# EAGLE design Clock_M-D (EAGLE 9.6.2)
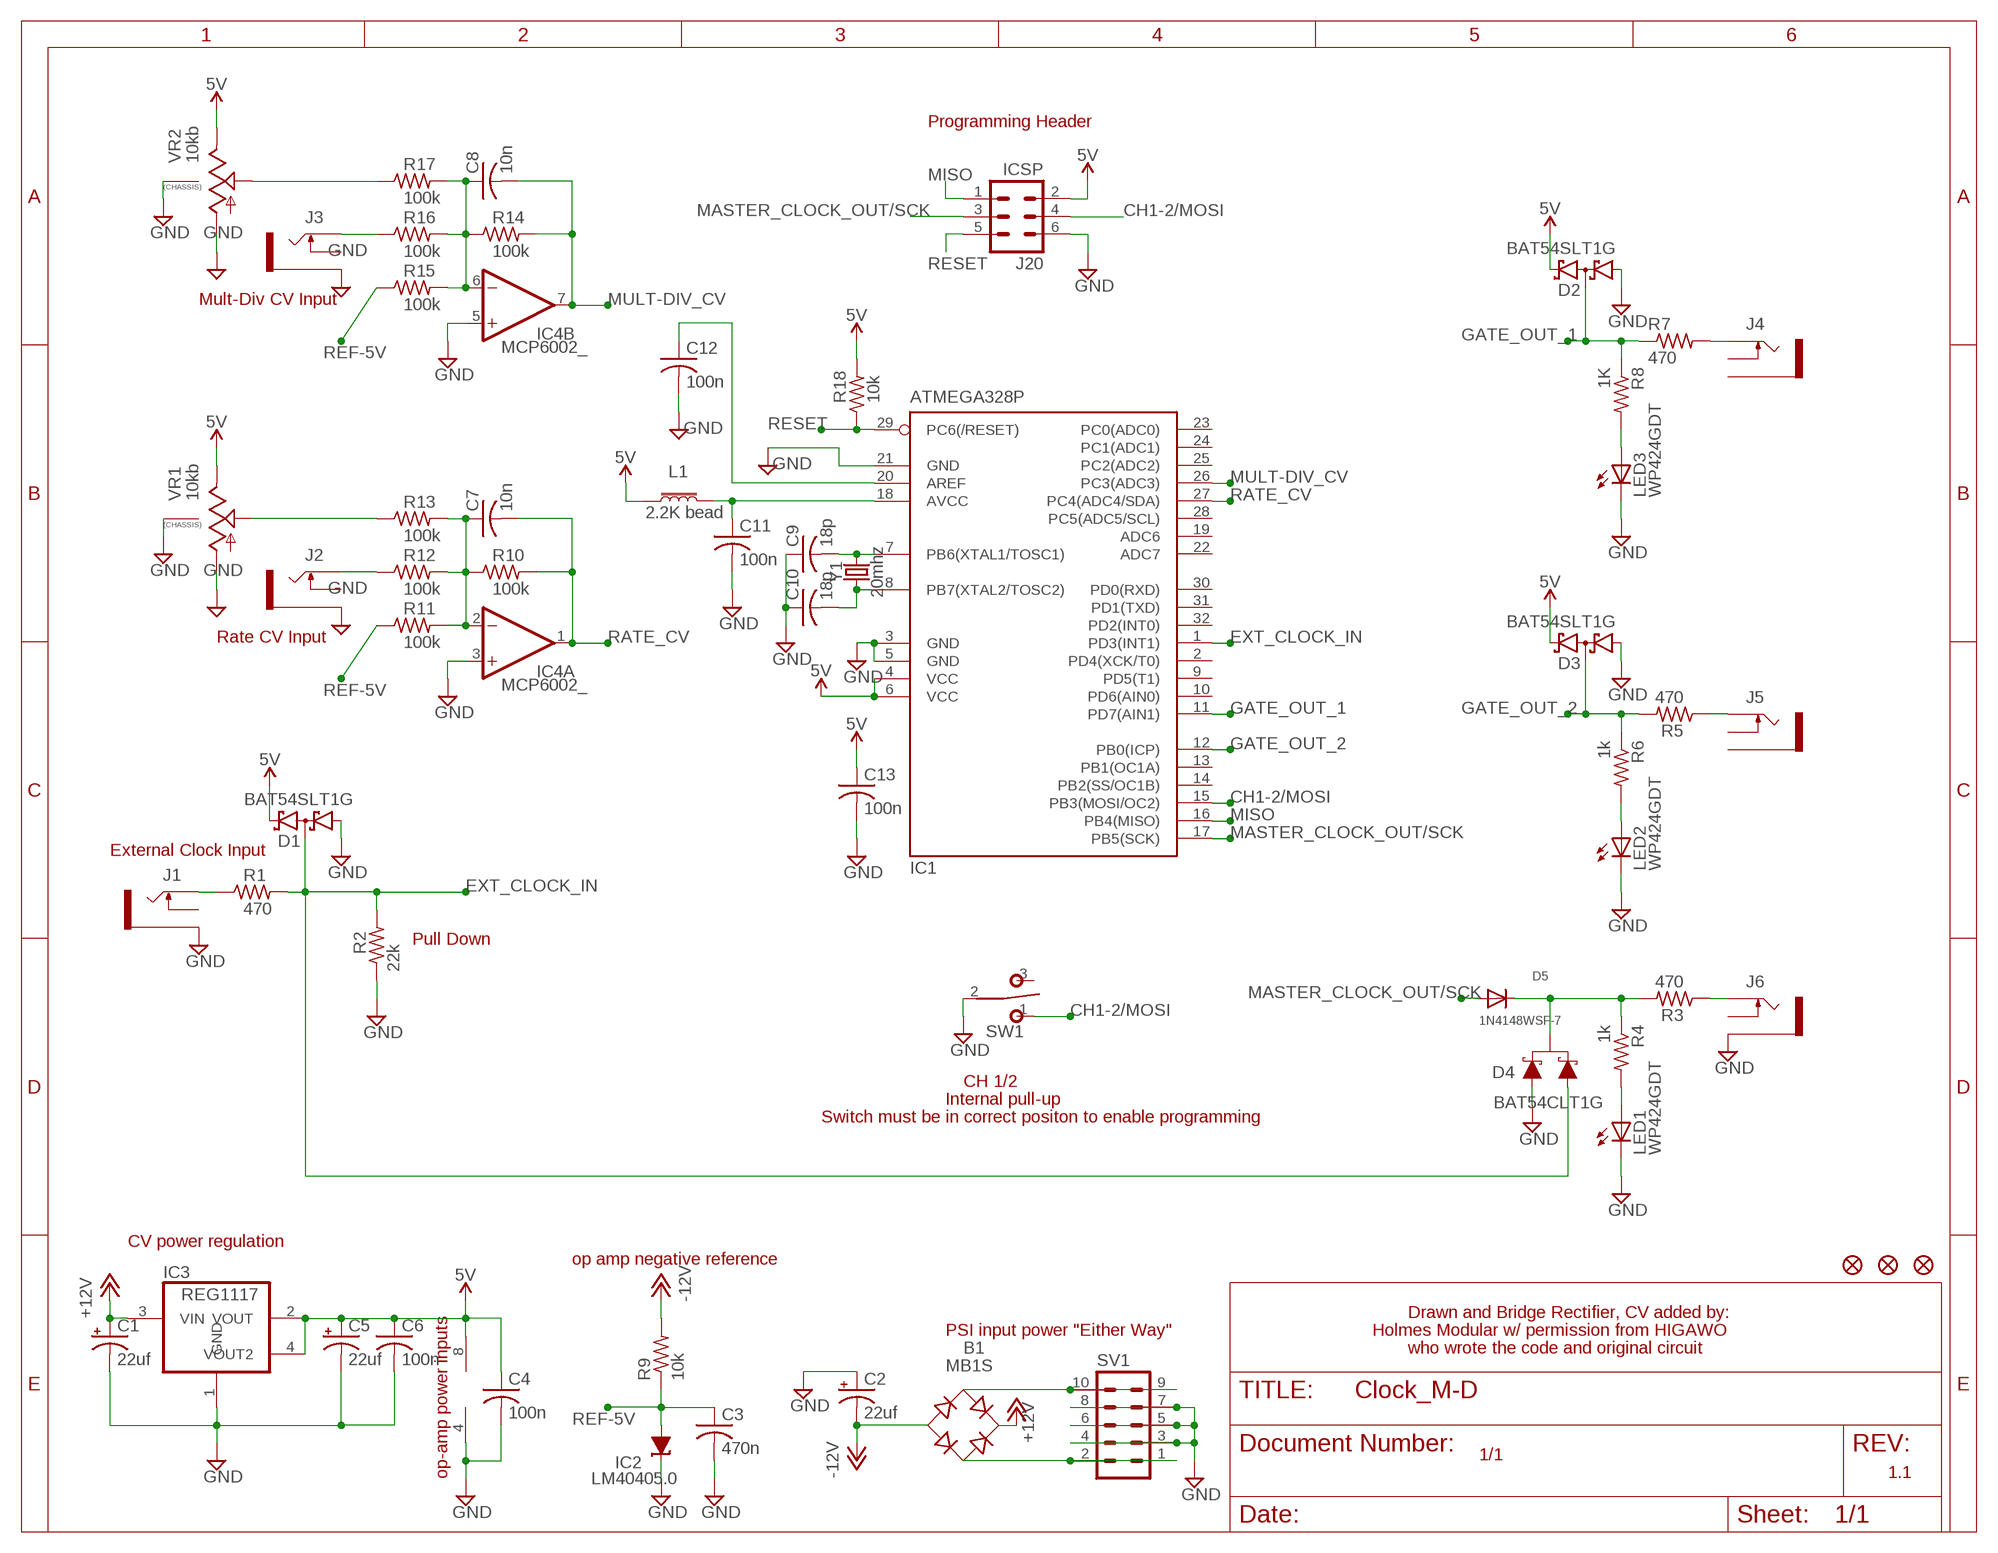
[diagram p0: schematic, sheet 1]

## Parts
B1  MB1S  [SOIC-4]
C1  22uf  CPOL-USC  [PANASONIC_C]
C2  22uf  CPOL-USC  [PANASONIC_C]
C3  470n  C-USC0805K  [C0805K]
C4  100n  C-USC0805K  [C0805K]
C5  22uf  CPOL-USC  [PANASONIC_C]
C6  100n  C-USC0805K  [C0805K]
C7  10n  C-USC0805K  [C0805K]
C8  10n  C-USC0805K  [C0805K]
C9  18p  C-USC0805K  [C0805K]
C10  18p  C-USC0805K  [C0805K]
C11  100n  C-USC0805K  [C0805K]
C12  100n  C-USC0805K  [C0805K]
C13  100n  C-USC0805K  [C0805K]
D1  BAT54SLT1G  BAS40-04  [SOT23]
D2  BAT54SLT1G  BAS40-04  [SOT23]
D3  BAT54SLT1G  BAS40-04  [SOT23]
D4  BAT54CLT1G  DIODE-SCHOTTKY-DUAL  [SOT23-3]
D5  1N4148WSF-7  DIODESOD-323F  [SOD-323F]
FD1  FIDUCIAL1X2  [FIDUCIAL-1X2]
FD2  FIDUCIAL1X2  [FIDUCIAL-1X2]
FD3  FIDUCIAL1X2  [FIDUCIAL-1X2]
IC1  ATMEGA328P  MEGA8-AI  [TQFP32-08]
IC2  LM40405.0  LM4041A12DBZ  [DBZ_R-PDSO-G3]
IC3  REG1117  [SOT223]
IC4  MCP6002_  [SO08]
J1  THONKICONNNEW  [WQP-PJ301M-12_JACK]
J2  THONKICONNNEW  [WQP-PJ301M-12_JACK]
J3  THONKICONNNEW  [WQP-PJ301M-12_JACK]
J4  THONKICONNNEW  [WQP-PJ301M-12_JACK]
J5  THONKICONNNEW  [WQP-PJ301M-12_JACK]
J6  THONKICONNNEW  [WQP-PJ301M-12_JACK]
J20  ICSP  MA03-2  [MA03-2]
L1  2.2K bead  FERRITE_BEAD-0603  [0603]
LED1  WP424GDT  LED3MM  [LED3MM]
LED2  WP424GDT  LED3MM  [LED3MM]
LED3  WP424GDT  LED3MM  [LED3MM]
R1  470  R-US_R0805  [R0805]
R2  22k  R-US_R0805  [R0805]
R3  470  R-US_R0805  [R0805]
R4  1k  R-US_R0805  [R0805]
R5  470  R-US_R0805  [R0805]
R6  1k  R-US_R0805  [R0805]
R7  470  R-US_R0805  [R0805]
R8  1K  R-US_R0805  [R0805]
R9  10k  R-US_R0805  [R0805]
R10  100k  R-US_R0805  [R0805]
R11  100k  R-US_R0805  [R0805]
R12  100k  R-US_R0805  [R0805]
R13  100k  R-US_R0805  [R0805]
R14  100k  R-US_R0805  [R0805]
R15  100k  R-US_R0805  [R0805]
R16  100k  R-US_R0805  [R0805]
R17  100k  R-US_R0805  [R0805]
R18  10k  R-US_R0805  [R0805]
SV1  EURO_POWER_HEADERLOCK  10PIN_BACKSIDE  [10PIN_BACKSIDE]
SW1  T-80-T-SPDT-ON-OFF-ON  [M9040P]
VR1  10kb  9MM_SNAP-IN_POT_CHASSIS  [9MM_SNAP-IN_POT]
VR2  10kb  9MM_SNAP-IN_POT_CHASSIS  [9MM_SNAP-IN_POT]
Y1  20mhz  CRYSTALSMD-5X3.2-2PAD  [CRYSTAL-SMD-5X3.2-2PAD]

## Nets
5V: C4.1 C5.+ C6.1 C13.1 D1.2(C2) D2.2(C2) D3.2(C2) IC1.4(VCC) IC1.6(VCC) IC3.2(VOUT) IC3.4(VOUT2) IC4.8(P:V+) J20.2 L1.1 R18.2 VR1.3(E) VR2.3(E)
+12V: B1.+ C1.+ IC3.3(VIN)
-12V: B1.- C2.- R9.2
CH1-2/MOSI: IC1.15(PB3(MOSI/OC2)) J20.4 SW1.1(O)
EXT_CLOCK_IN: D1.3(C1A2) D4.2(A1) IC1.1(PD3(INT1)) R1.2 R2.2
GATE_OUT_1: D2.3(C1A2) IC1.11(PD7(AIN1)) R7.1 R8.1
GATE_OUT_2: D3.3(C1A2) IC1.12(PB0(ICP)) R5.2 R6.1
GND: C1.- C2.+ C3.2 C4.2 C5.- C6.2 C9.1 C10.1 C11.2 C12.2 C13.2 D1.1(A1) D2.1(A1) D3.1(A1) D4.1(A) IC1.3(GND) IC1.5(GND) IC1.21(GND) IC2.1(C) IC3.1(GND) IC4.3(A:+IN) IC4.4(P:V-) IC4.5(B:+IN) J1.P$3_SLEEVE(SLEEVE) J2.P$3_SLEEVE(SLEEVE) J3.P$3_SLEEVE(SLEEVE) J6.P$3_SLEEVE(SLEEVE) J20.6 LED1.K(C) LED2.K(C) LED3.K(C) R2.1 SV1.3 SV1.4 SV1.5 SV1.6 SV1.7 SV1.8 SW1.2(P) VR1.1(A) VR1.CHASSIS1 VR1.CHASSIS2 VR2.1(A) VR2.CHASSIS1 VR2.CHASSIS2
MASTER_CLOCK_OUT/SCK: D5.A IC1.17(PB5(SCK)) J20.3
MISO: IC1.16(PB4(MISO)) J20.1
MULT-DIV_CV: C8.2 IC1.26(PC3(ADC3)) IC4.7(B:OUT) R14.2
N$1: B1.~1(AC1) SV1.9 SV1.10
N$2: B1.~2(AC2) SV1.1 SV1.2
N$3: J1.P$1_TIP(TIP) R1.1
N$4: D4.3(C) D5.C R3.2 R4.1
N$5: LED1.A R4.2
N$6: J6.P$1_TIP(TIP) R3.1
N$7: LED2.A R6.2
N$8: J5.P$1_TIP(TIP) R5.1
N$9: J4.P$1_TIP(TIP) R7.2
N$10: LED3.A R8.2
N$12: C7.1 IC4.2(A:-IN) R10.1 R11.2 R12.2 R13.2
N$13: J2.P$1_TIP(TIP) R12.1
N$14: R13.1 VR1.2(S)
N$15: R17.1 VR2.2(S)
N$16: J3.P$1_TIP(TIP) R16.1
N$17: C8.1 IC4.6(B:-IN) R14.1 R15.2 R16.2 R17.2
N$23: C11.1 IC1.18(AVCC) L1.2
N$24: C9.2 IC1.7(PB6(XTAL1/TOSC1)) Y1.P$2
N$25: C10.2 IC1.8(PB7(XTAL2/TOSC2)) Y1.P$1
N$26: C12.1 IC1.20(AREF)
RATE_CV: C7.2 IC1.27(PC4(ADC4/SDA)) IC4.1(A:OUT) R10.2
REF-5V: C3.1 IC2.2(A) R9.1 R11.1 R15.1
RESET: IC1.29(PC6(/RESET)) J20.5 R18.1
Unconnected: IC1.2(PD4(XCK/T0)) IC1.9(PD5(T1)) IC1.10(PD6(AIN0)) IC1.13(PB1(OC1A)) IC1.14(PB2(SS/OC1B)) IC1.19(ADC6) IC1.22(ADC7) IC1.23(PC0(ADC0)) IC1.24(PC1(ADC1)) IC1.25(PC2(ADC2)) IC1.28(PC5(ADC5/SCL)) IC1.30(PD0(RXD)) IC1.31(PD1(TXD)) IC1.32(PD2(INT0)) J1.P$2_SWITCH(SWITCH) J2.P$2_SWITCH(SWITCH) J3.P$2_SWITCH(SWITCH) J4.P$2_SWITCH(SWITCH) J4.P$3_SLEEVE(SLEEVE) J5.P$2_SWITCH(SWITCH) J5.P$3_SLEEVE(SLEEVE) J6.P$2_SWITCH(SWITCH) SW1.3(S)

## Notes on the sheet
- Programming Header
- Mult-Div CV Input
- Rate CV Input
- External Clock Input
- Pull Down
- CH 1/2
- Internal pull-up
- Switch must be in correct positon to enable programming
- CV power regulation
- op amp negative reference
- Drawn and Bridge Rectifier, CV added by:
- PSI input power "Either Way" | Holmes Modular w/ permission from HIGAWO
- who wrote the code and original circuit
- 1/1
- op-amp power inputs | 1.1

## Library data of the parts
B1 = rectifier:MB*S: Bridge Rectifier Source: http://www.fairchildsemi.com/ds/MB/MB6S.pdf
C1 C2 C5 = rcl:CPOL-US: POLARIZED CAPACITOR, American symbol; SPICEPREFIX: C
C3 C4 C6-C13 = rcl:C-US: CAPACITOR, American symbol; SPICEPREFIX: C
D1-D3 = diode:BAS40-04: Silicon Schottky Diodes General-purpose diode for high-speed switching
D4 = SparkFun-DiscreteSemi:DIODE-SCHOTTKY-DUAL: Diodes Incorporated - BAS70-05 Dual Schottky Diode Two Schottky Diodes in a single SOT-23 package. Low reverse current (100 nA) Vf: Datasheet referenced for footprint <https://www.diodes.com/assets/Datasheets/ds11007.pdf>; PROD_ID: DIO-14829; VALUE: BAS70-05
D5 = adafruit:DIODE: Diode SMADIODE - SMA Surface Mount Package 20V 1A Schottky Diode Digikey: 641-1014-6-ND DO-1N4148 - Through Hole Small Current Diode SOD-123 20V 1 A (.5mV Vf) Schottky Diode - Digikey: MBRX120TPMSCT-ND SOD-323 10V 570mA (.38mV Vf, 3ns) Schottky Diode - Digikey: ZLLS410CT-ND SOD-523 30V 30mA Schottky Diode (RB751S-40TE61) - Digikey: RB751S-40TE61CT-ND SOT23-R/W - SOT23 Package (R = Solder Paste/Reflow Ovens, W = Hand-Soldering) BAT54Film 40V 300mA - Digikey: 497-7162-1-ND
FD1-FD3 = SparkFun-Aesthetics:FIDUCIAL: Fiducial Alignment Points Point-of-reference for pick-and-place machines and other optical instruments.
IC1 = atmel:MEGA8: MICROCONTROLLER 8 Kbytes FLASH, 1 kbytes SRAM, 512 bytes EEPROM, USART, 6-channel 10 bit ADC, 2-channel 8 bit ADC Pin compatible with Atmega48, ATMega88, ATMega168 Source: avr.lbr; MPN: ATMEGA8-16AU; OC_FARNELL: 9171371; OC_NEWARK: 73M8863
IC2 = texas:LM4041: PRECISION MICROPOWER SHUNT VOLTAGE REFERENCE Source: http://focus.ti.com/lit/ds/slcs146e/slcs146e.pdf; MPN: LM4041A12IDBZR; OC_FARNELL: 1407949; OC_NEWARK: 58K5875
IC3 = burr-brown:REG1117: 800mA and 1A Low Dropout (LDO) Positive Regulator 1.8V, 2.5V, 2.85V, 3.3V, 5V, and Adj; MPN: REG1117; OC_FARNELL: 1097566; OC_NEWARK: 14P6981
IC4 = MusicThingModular:MCP6002: Generic Dual Op Amp
J1-J6 = MusicThingModular:THONKICONN: 3.5mm socket for Eurorack modular synths
J20 = con-lstb:MA03-2: PIN HEADER; OC_FARNELL: unknown; OC_NEWARK: unknown
L1 = SparkFun-Coils:FERRITE_BEAD: Ferrite Bead (blocks, cores, rings, chokes, etc.) Inductor with layers of ferrite used to suppress high frequencies. Often used to isolate high frequency noise. SparkFun Products: IOIO-OTG - V2.2 <https://www.sparkfun.com/products/13613> SparkFun SAMD21 Mini Breakout <https://www.sparkfun.com/products/13664> SparkFun 6 Degrees of Freedom Breakout - LSM6DS3 <https://www.sparkfun.com/products/13339> SparkFun SAMD21 Dev Breakout <https://www.sparkfun.com/products/13672> Lilypad MP3 <https://www.sparkfun.com/products/11013>; PROD_ID: NDUC-13805; VALUE: 30Ω/1.8A
LED1-LED3 = adafruit:LED: LED OSRAM: - CHIPLED LG R971, LG N971, LY N971, LG Q971, LY Q971, LO R971, LY R971 LH N974, LH R974 LS Q976, LO Q976, LY Q976 LO Q996 - Hyper CHIPLED LW Q18S LB Q993, LB Q99A, LB R99A - SideLED LS A670, LO A670, LY A670, LG A670, LP A670 LB A673, LV A673, LT A673, LW A673 LH A674 LY A675 LS A676, LA A676, LO A676, LY A676, LW A676 LS A679, LY A679, LG A679 - Hyper Micro SIDELED® LS Y876, LA Y876, LO Y876, LY Y876 LT Y87S - SmartLED LW L88C, LW L88S LB L89C, LB L89S, LG L890 LS L89K, LO L89K, LY L89K LS L896, LA L896, LO L896, LY L896 - TOPLED LS T670, LO T670, LY T670, LG T670, LP T670 LSG T670, LSP T670, LSY T670, LOP T670, LYG T670 LG T671, LOG T671, LSG T671 LB T673, LV T673, LT T673, LW T673 LH T674 LS T676, LA T676, LO T676, LY T676, LB T676, LH T676, LSB T676, LW T676 LB T67C, LV T67C, LT T67C, LS T67K, LO T67K, LY T67K, LW E67C LS E67B, LA E67B, LO E67B, LY E67B, LB E67C, LV E67C, LT E67C LW T67C LS T679, LY T679, LG T679 LS T770, LO T770, LY T770, LG T770, LP T770 LB T773, LV T773, LT T773, LW T773 LH T774 LS E675, LA E675, LY E675, LS T675 LS T776, LA T776, LO T776, LY T776, LB T776 LHGB T686 LT T68C, LB T68C - Hyper Mini TOPLED® LB M676 - Mini TOPLED Santana® LG M470 LS M47K, LO M47K, LY M47K Source: http://www.osram.convergy.de/
R1-R18 = rcl:R-US_: RESISTOR, American symbol; SPICEPREFIX: R
SV1 = MusicThingModular:10PIN_BACKSIDE: PIN HEADER; OC_FARNELL: unknown; OC_NEWARK: unknown
SW1 = MusicThingModular:T-80-T-SPDT-ON-OFF-ON
VR1 VR2 = MusicThingModular:9MM_SNAP-IN_POT_CHASSIS: 9mm vertical snap-in pot, Alpha / Panasonic style, with a connection to the metal chassis for grounding
Y1 = SparkFun-Clocks:CRYSTAL: Crystals (Generic) These are passive quartz crystals, which can be used as a clock source for a microcontroller. Crystal's are two-terminal devices. They require external "load" capacitors to generate an oscillating signal.

## Board
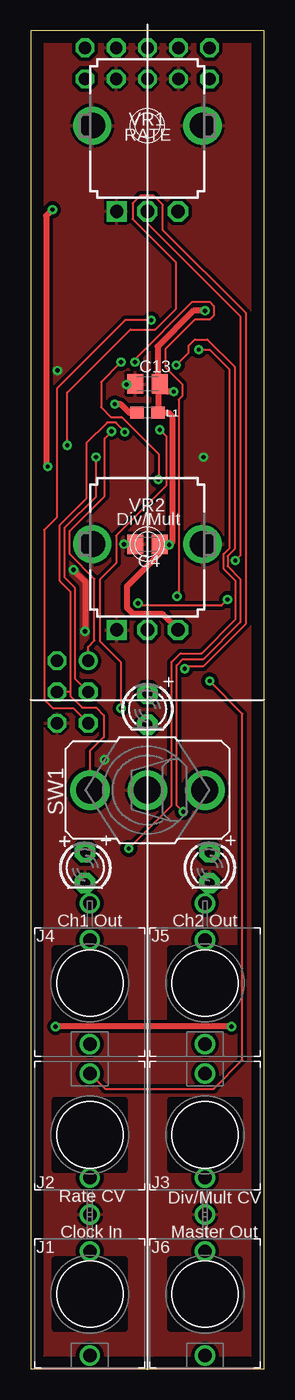
[diagram p1: board, top side]
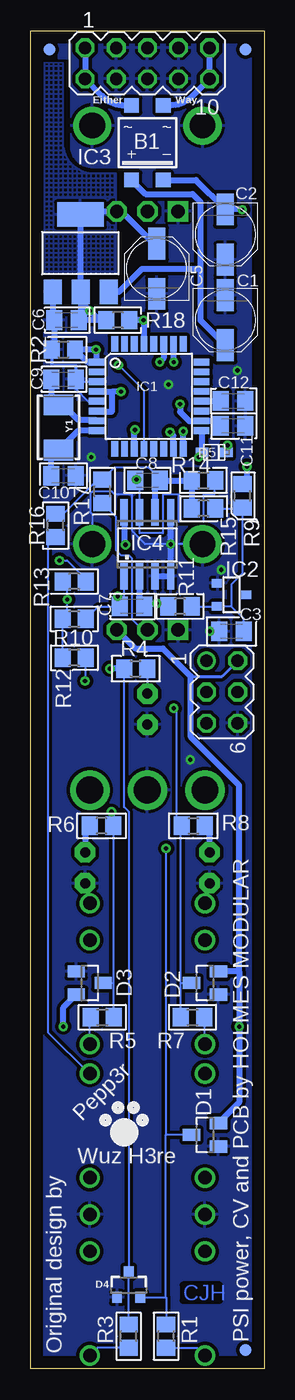
[diagram p2: board, bottom side, seen from below]

Size 19.05 x 109.22 mm. Coordinates in mm from the lower left corner, seen from the top.
Outline: 0,0 19.05,0 19.05,109.22 0,109.22 0,0
Copper layers (1*16): Top 0.035mm / dielectric 1.5mm / Bottom 0.035mm
Design rules "default": minimum track width 6mil, minimum drill 0.35mm, track to track 6mil, track to pad 6mil, pad to pad 6mil, via to via 6mil, smd to smd 6mil, copper to edge 40mil, drill to drill 6mil, minimum pad ring 10mil, minimum via ring 8mil, stop-mask expansion 4mil, vias tented up to drill 0mil, thermal gap 10mil
bRestrict: area 14.5,78 to 15.2,78.6; 2 lines

### Footprints (pad centres in the part's own frame; a part is rotated, then mirrored left to right if it is on the bottom)
SOIC-4 = smd 1.2 x 1.2: + 1.3,3.05; - -1.3,3.05; ~1 -1.3,-3.05; ~2 1.3,-3.05
PANASONIC_C = smd 2.6 x 1.4: + 2.05,0; - -2.05,0
C0805K = smd 1.3 x 1.6: 1 -1,0; 2 1,0
SOT23 = smd 1 x 1.4: 1 -0.95,-1.1; 2 0.95,-1.1; 3 0,1.1
SOT23-3 = smd 0.8 x 0.9: 1 -0.95,-1; 2 0.95,-1; 3 0,1.1
SOD-323F = smd 1 x 0.8: A -1,0; C 1,0
FIDUCIAL-1X2 = smd 1 x 1: 1 0,0
TQFP32-08 = smd 1.27 x 0.559: 1 -4.293,2.8; 2 -4.293,2; 3 -4.293,1.2; 4 -4.293,0.4; 5 -4.293,-0.4; 6 -4.293,-1.2; 7 -4.293,-2; 8 -4.293,-2.8; 17 4.293,-2.8; 18 4.293,-2; 19 4.293,-1.2; 20 4.293,-0.4; 21 4.293,0.4; 22 4.293,1.2; 23 4.293,2; 24 4.293,2.8 | smd 0.559 x 1.27: 9 -2.8,-4.293; 10 -2,-4.293; 11 -1.2,-4.293; 12 -0.4,-4.293; 13 0.4,-4.293; 14 1.2,-4.293; 15 2,-4.293; 16 2.8,-4.293; 25 2.8,4.293; 26 2,4.293; 27 1.2,4.293; 28 0.4,4.293; 29 -0.4,4.293; 30 -1.2,4.293; 31 -2,4.293; 32 -2.8,4.293
DBZ_R-PDSO-G3 = smd 0.7 x 1: 1 -0.95,-1.1; 2 0.95,-1.1; 3 0,1.1
SOT223 = smd 1.499 x 2.007: 1 -2.261,-3.15; 2 0.025,-3.15; 3 2.311,-3.15 | smd 3.81 x 2.007: 4 0,3.15
SO08 = smd 0.6 x 2.2: 1 -1.905,-2.6; 2 -0.635,-2.6; 3 0.635,-2.6; 4 1.905,-2.6; 5 1.905,2.6; 6 0.635,2.6; 7 -0.635,2.6; 8 -1.905,2.6
WQP-PJ301M-12_JACK = drill 1.1: P$1_TIP 0,5; P$2_SWITCH 0,-3.5; P$3_SLEEVE 0,-6.5
MA03-2 = drill 1.016: 1 -2.54,-1.27 | drill 1.016 octagon: 2 -2.54,1.27; 3 0,-1.27; 4 0,1.27; 5 2.54,-1.27; 6 2.54,1.27
0603 = smd 1.1 x 1: 1 -0.85,0; 2 0.85,0
LED3MM = drill 0.813 pad 1.676 octagon: A -1.27,0; K 1.27,0
R0805 = smd 1.3 x 1.5: 1 -0.95,0; 2 0.95,0
10PIN_BACKSIDE = drill 1.016 octagon: 1 -5.08,-1.27; 2 -5.08,1.27; 3 -2.54,-1.27; 4 -2.54,1.27; 5 0,-1.27; 6 0,1.27; 7 2.54,-1.27; 8 2.54,1.27; 9 5.08,-1.27; 10 5.08,1.27
M9040P = drill 2.2: 1 0,4.699 | drill 2.2 pad 3: 2 0,0; 3 0,-4.699
9MM_SNAP-IN_POT = drill 1.1 square: 1 -2.5,-7 | drill 1.1 octagon: 2 0,-7; 3 2.5,-7 | drill 2.1 pad 2.794: CHASSIS1 -4.5,0; CHASSIS2 4.5,0
CRYSTAL-SMD-5X3.2-2PAD = smd 1.7 x 2.4: P$1 1.85,0; P$2 -1.85,0

### Placement (x,y rotation side)
B1  9.53,100.08 180 bottom
C1  3.17,85.6 270 bottom
C2  3.17,92.58 270 bottom
C3  2.67,60.2 180 bottom
C4  9.53,67.31 180 top
C5  8.76,89.79 90 bottom
C6  16.13,85.6 180 bottom
C7  10.79,62.23 180 bottom
C8  9.53,72.52 180 bottom
C9  16.38,80.77 180 bottom
C10  16.38,72.9 180 bottom
C11  2.54,76.96 0 bottom
C12  2.54,78.99 0 bottom
C13  9.53,80.39 180 top
D1  4.83,19.1 90 bottom
D2  4.83,31.5 90 bottom
D3  14.22,31.5 270 bottom
D4  11.05,6.83 0 bottom
D5  4.06,74.8 0 bottom
FD1  1.52,107.7 0 bottom
FD2  17.53,107.7 0 bottom
FD3  1.52,1.52 0 bottom
IC1  9.4,79.38 0 bottom
IC2  LM4040.....  [DBZ_R-PDSO-G3]  2.67,63.18 270 bottom
IC3  14.99,91.06 0 bottom
IC4  9.53,67.31 0 bottom
J1  4.83,6.1 180 top
J2  4.83,19.1 0 top
J3  14.22,19.1 0 top
J4  4.83,31.5 180 top
J5  14.22,31.5 180 top
J6  14.22,6.1 180 top
J20  3.43,55.24 270 bottom
L1  9.53,78.04 180 top
LED1  9.53,53.85 270 top
LED2  14.61,40.89 270 top
LED3  4.45,40.89 270 top
R1  8,2.67 90 bottom
R2  16.38,83.19 0 bottom
R3  11.05,2.67 90 bottom
R4  10.48,57.15 0 bottom
R5  13.21,28.7 0 bottom
R6  13.27,44.32 180 bottom
R7  5.84,28.7 0 bottom
R8  5.78,44.32 0 bottom
R9  1.78,71.25 90 bottom
R10  15.49,61.21 0 bottom
R11  6.86,62.23 180 bottom
R12  15.49,58.04 180 bottom
R13  15.49,64.26 180 bottom
R14  4.95,72.52 0 bottom
R15  4.95,70.23 180 bottom
R16  17.02,68.83 90 bottom
R17  13.21,71.63 90 bottom
R18  11.94,85.6 180 bottom
SV1  9.53,106.55 180 top
SW1  9.53,47.24 90 top
VR1  9.53,101.47 0 top
VR2  9.53,67.31 0 top
Y1  16.76,76.83 270 bottom

### Tracks (layer width: path | path; a pad name or v marks a point on that pad's centre or on a via)
5V  (via drill 0.35)
  Top 0.508: v11.3,67.25 10.59,67.25 C4.1 | v16.38,27.94 v2.03,27.94 | v11.3,67.25 11.56,67.5 11.56,77.75 11.26,78.04 L1.1 10.4,78.04 10.4,80.26 C13.1 11.16,79.76 v11.68,79.76 10.35,79.76 10.35,83.44 13.27,86.36 v14.22,86.36 | VR2.3 12.03,60.37 10.79,61.59 8.38,61.59 7.87,62.1 7.87,63.88 10.48,66.48 10.48,67.25 v11.3,67.25
  Bottom 0.254: J20.2 3.43,56.52 5.97,56.52
  Bottom 0.508: C5.+ 9.01,91.84 11.65,94.47 VR1.3 14.72,94.47 IC3.4 14.99,87.94 IC3.2 | IC3.2 14.96,85.77 C6.1 | C6.1 R18.2 13.46,85.6 v14.22,86.36 | IC4.8 11.43,67.37 v11.3,67.25 | IC1.4 13.67,79.76 12.45,79.76 | 12.45,79.76 12.45,78.11 13.62,78.11 IC1.6 | IC3.2 14.96,87.1 v14.22,86.36 | C6.1 14.37,86.36 v14.22,86.36 | v11.68,79.76 12.45,79.76 | D1.2 2.03,21.75 v2.03,27.94 2.03,32.45 | v16.38,27.94 16.38,29.49 D3.2 | 2.03,32.45 D2.2 | 2.03,32.45 2.03,47.62 5.97,51.56 5.97,56.52 8.26,58.8 10.52,58.8 VR2.3
  pour Bottom (hatched): 18.03,89.41 12.06,89.41 12.06,97.54 13.84,97.54 arc90 16.38,100.08 16.38,106.55 18.03,106.55
+12V
  Bottom 0.508: B1.+ 9.68,95.89 5.84,95.89 5.21,95.25 5.21,89.79 | C1.+ 5.21,85.58 5.21,89.79 | 5.21,89.79 9.96,89.79 11.84,87.91 IC3.3
-12V  (via drill 0.35)
  Top 0.508: v1.78,94.61 1.27,94.11 1.27,73.76 v1.4,73.64
  Bottom 0.152: 1.4,73.53 v1.4,73.64
  Bottom 0.508: B1.- 5.57,97.03 C2.- 1.8,94.63 v1.78,94.61 | R9.2 1.4,72.58 1.4,73.53
CH1-2/MOSI  (via drill 0.35)
  Top 0.152: v7.68,76.45 7.68,76.5 6.94,77.24 6.24,77.24 4.56,75.56 4.56,71.04 2.35,68.83 2.35,64.33 3.25,63.42 3.25,55.24 | 3.25,55.24 J20.4 | 3.25,55.24 3.25,54.91 4.19,53.98 5.33,53.98 5.97,53.34 5.97,51.56 4.83,50.42 SW1.1
  Bottom 0.508: IC1.15 7.4,76.17 v7.68,76.45
EXT_CLOCK_IN  (via drill 0.35)
  Top 0.152: v13.72,83.19 14.62,83.19 16.19,81.61 16.19,66.95 15.75,66.51 15.75,65.29 16.71,64.33 16.71,61.16 13.95,58.4 12.21,58.4 11.51,57.7 11.51,45.99 v8,42.48
  Bottom 0.152: D4.2 8.01,5.83 | 8.01,5.83 8,5.84 R1.2 | 8.01,5.83 8.01,19.09 | 8.01,19.09 8,19.1 D1.3 | v8,42.48 v8.01,42.47 8.01,19.09
  Bottom 0.508: R2.2 14.42,82.17 IC1.1 13.72,82.17 v13.72,83.19 R2.2
GATE_OUT_1  (via drill 0.35)
  Top 0.152: v10.54,76.64 11.05,76.14 11.05,72.07 6.98,68 6.98,65.76 5.65,64.44 5.65,59.39 7.37,57.68 v7.37,53.91
  Bottom 0.152: v7.37,53.91 7.18,53.72 7.18,44.77 R8.1 6.79,44.32 6.79,31.5 | R7.1 6.79,31.5 | 6.79,31.5 D2.3
  Bottom 0.508: IC1.11 10.6,76.37 10.54,76.43 v10.54,76.64
GATE_OUT_2  (via drill 0.35)
  Top 0.152: v12.44,45.47 11.91,45.99 11.91,57.42 12.43,57.94 14.12,57.94 17.12,60.94 17.12,64.45 16.07,65.51 16.07,66.34 16.64,66.91 16.64,81.79 14.41,84.01 13.4,84.01 12.89,83.5 12.89,82.93 v11.87,81.92
  Top 0.254: v12.45,45.47 v12.44,45.47
  Bottom 0.152: R6.1 12.32,31.5 | 12.32,31.5 12.32,28.77 | D3.3 12.32,31.5 | IC1.12 9.8,79.84 v11.87,81.92
  Bottom 0.508: 12.32,28.77 arc-90 R5.2 | v12.45,45.47 12.45,44.45 R6.1
GND  (via drill 0.35)
  Top 0.508: C4.2 v7.62,67.31 | v3.49,65.22 4.45,64.26 v4.45,60.2
  Bottom 0.152: 15.37,80.79 C9.1 | C9.1 15.19,80.58 IC1.3 | IC1.5 13.72,78.95 14.33,78.95 15.38,80 C9.1 | VR2.CHASSIS1 9.7,67.31 10.77,68.38 10.77,71.37 12.17,71.37 12.43,71.62 13.99,71.62 14.19,71.42 14.19,69.93 14.03,69.77 VR2.CHASSIS2
  Bottom 0.254: R2.1 17.33,81.98 17.27,81.92 15.37,81.92 15.37,80.79
  Bottom 0.508: IC4.5 v7.62,67.31 IC4.4 IC4.3 | IC3.1 17.25,85.72 C6.2 17.13,83.39 R2.1
  other vias: 7.81,80.33 2.18,81.48 6.03,49.72 14.1,74.42
  pour Bottom (isolate 0.279): 0,0 19.05,0 19.05,88.9 11.43,88.9 11.43,98.04 13.97,98.04 arc90 15.75,99.82 15.75,106.93 16.76,106.93 16.76,107.7 arc-90 17.53,108.46 18.8,108.46 arc-90 19.05,108.2 19.05,109.22 0,109.22
  pour Top (isolate 0.305): 19.05,109.22 0,109.22 0,0 19.05,0
MASTER_CLOCK_OUT/SCK  (via drill 0.35)
  Top 0.152: v5.33,74.42 5.33,71.18 2.76,68.61 2.76,64.61 3.61,63.77 3.61,56.34 J20.3
  Bottom 0.508: IC1.17 5.11,74.84 D5.A 5.33,74.53 v5.33,74.42
MISO  (via drill 0.35)
  Top 0.152: v6.6,76.52 6.03,75.95 6.03,71.25 3.17,68.39 3.17,66.51 5.21,64.47 5.21,59.44 4.7,58.93 J20.1
  Bottom 0.508: IC1.16 v6.6,76.51 v6.6,76.52
MULT-DIV_CV  (via drill 0.35)
  Top 0.152: v7.37,82.17 5.74,80.55 5.74,78.49 6.54,77.7 7.43,77.7 10.45,74.67 10.45,72.62 v10.41,72.58
  Bottom 0.152: 10.16,72.15 IC4.7 10.16,68.2 8.26,68.2 8.26,71.37 6.96,71.37 6.96,69.15 4.96,69.15 4.96,71.37 4.06,71.37 4.06,72.46 R14.2 | C8.2 10.48,72.52 v10.41,72.58
  Bottom 0.508: 10.16,72.15 C8.2 | v7.37,82.17 7.37,83.64 IC1.26
N$1
  Bottom 0.508: SV1.9 SV1.10 5.86,103.87 arc45 7.65,103.13 B1.~1
N$2
  Bottom 0.508: SV1.1 SV1.2 13.19,103.87 arc-45 11.4,103.13 B1.~2
N$3
  Bottom 0.152: R1.1 5.45,1.72 J1.P$1_TIP
N$4  (via drill 0.35)
  Top 0.152: v2.98,75.37 2.98,79.69 8.13,84.84 10.16,84.84 11.87,86.55 11.87,90.3 8.32,93.85 8.32,95.12 8.96,95.76 10.03,95.76 10.78,95.01 10.78,92.95 17.54,86.19 17.54,60.79 14.08,57.33 12.75,57.33 v12.57,57.15
  Bottom 0.152: R3.2 D4.3 11.06,7.95 11.06,45.48 11.43,45.85 R4.1
  Bottom 0.508: D5.C 3.06,75.3 v2.98,75.37 | R4.1 v12.57,57.15
N$5
  Bottom 0.152: R4.2 LED1.A
  Bottom 0.508: LED1.A arc-90 LED1.A
N$6
  Bottom 0.152: R3.1 13.6,1.72 J6.P$1_TIP
N$7
  Bottom 0.508: LED2.A 14.6,43.94 R6.2
N$8
  Bottom 0.152: J5.P$1_TIP 14.22,28.64
  Bottom 0.508: 14.22,28.64 R5.1
N$9
  Bottom 0.152: J4.P$1_TIP 4.83,28.64
  Bottom 0.508: 4.83,28.64 R7.2
N$10
  Bottom 0.508: LED3.A 4.45,43.94 R8.2
N$12  (via drill 0.35)
  Top 0.152: v8.76,62.48 8.97,62.28 15.56,62.28 v16.07,62.79
  Bottom 0.152: R12.2 R10.1 16.07,61.59 v16.07,62.79 16.07,63.88 R13.2
  Bottom 0.508: IC4.2 10.16,62.59 C7.1 9.54,62.48 v8.76,62.48 8.06,62.48 R11.2
N$13  (via drill 0.35)
  Top 0.152: J2.P$1_TIP 6.07,22.86 14.92,22.86 17.27,25.21 17.27,53.47 v14.61,56.13
  Bottom 0.152: 14.61,57.98 v14.61,56.13
  Bottom 0.508: R12.1 14.61,57.98
N$14  (via drill 0.35)
  Top 0.152: VR1.2 9.53,93.5 17.11,85.92 17.11,66.38 v16.7,65.98
  Bottom 0.152: R13.1 14.54,64.45 16.07,65.98 v16.7,65.98
N$15
  Bottom 0.152: R17.1 12.09,69.56 12.09,66.83 11.68,66.42 11.05,66.42 10.79,66.17 10.79,61.21 9.89,60.31 VR2.2
N$16
  Bottom 0.152: J3.P$1_TIP 14.29,24.1 17.65,27.47 17.65,67.44 17.21,67.88 R16.1
N$17
  Bottom 0.152: C8.1 8.53,72.64 9.43,73.55 12.22,73.55 13.19,72.58 R17.2 13.59,72.58 16.38,69.78 R16.2
  Bottom 0.508: IC4.6 8.89,72.15 C8.1 R14.1 R15.2
N$23  (via drill 0.35)
  Top 0.508: L1.2 8.06,78.04 7.37,78.74 v6.86,78.74
  Bottom 0.508: C11.1 3.54,77.01 3.92,77.39 5.09,77.39 IC1.18 5.14,77.34 6.1,77.34 6.86,78.11 v6.86,78.74
N$24
  Bottom 0.508: C9.2 17.38,79.3 Y1.P$2 16.41,78.69 15.17,77.44 13.76,77.44 IC1.7
N$25
  Bottom 0.508: C10.2 17.38,74.37 Y1.P$1 15.17,76.58 IC1.8
N$26
  Bottom 0.254: 3.56,78.97 C12.1
  Bottom 0.508: IC1.20 3.56,78.97
RATE_CV  (via drill 0.35)
  Top 0.152: v11.94,63.06 12.06,63.18 12.06,79.09 12.38,79.41 12.38,80.37 10.99,81.77 10.99,83.23 13.37,85.62 14.6,85.62 14.96,85.98 14.96,86.74 14.6,87.09 13.2,87.09 8.53,82.43 8.53,82.19 v8.51,82.17
  Bottom 0.152: 11.43,62.59 IC4.1 | R10.2 13.53,62.23 C7.2
  Bottom 0.508: 11.43,62.59 C7.2 11.86,62.29 11.86,62.98 v11.94,63.06 | IC1.27 8.2,82.48 v8.51,82.17
REF-5V
  Bottom 0.152: R11.1 IC2.2 2.67,62.23 | R15.1 1.84,70.23 | C3.1 1.67,61.23 2.67,62.23 | R9.1 1.78,64.9 2.67,64.01 2.67,62.23
  Bottom 0.508: IC2.2 | 1.84,70.23 R9.1
RESET  (via drill 0.35)
  Top 0.152: v9.84,85.6 7.71,85.6 2.14,80.02 2.14,69.5 1.1,68.47 1.1,54.64 1.81,53.94 3.47,53.94 J20.5
  Bottom 0.508: IC1.29 9.8,85.55 v9.84,85.6 R18.1

### Text on the board
Bottom: CJH
tNames: RATE | Div/Mult | Ch1 Out | Ch2 Out | Rate CV | Div/Mult CV | Clock In | Master Out
bNames: Way | Either | . | PSI power, CV and PCB by HOLMES MODULAR | Pepp3r | Wuz H3re | Original design by
bStop: HAGIWO | CJH